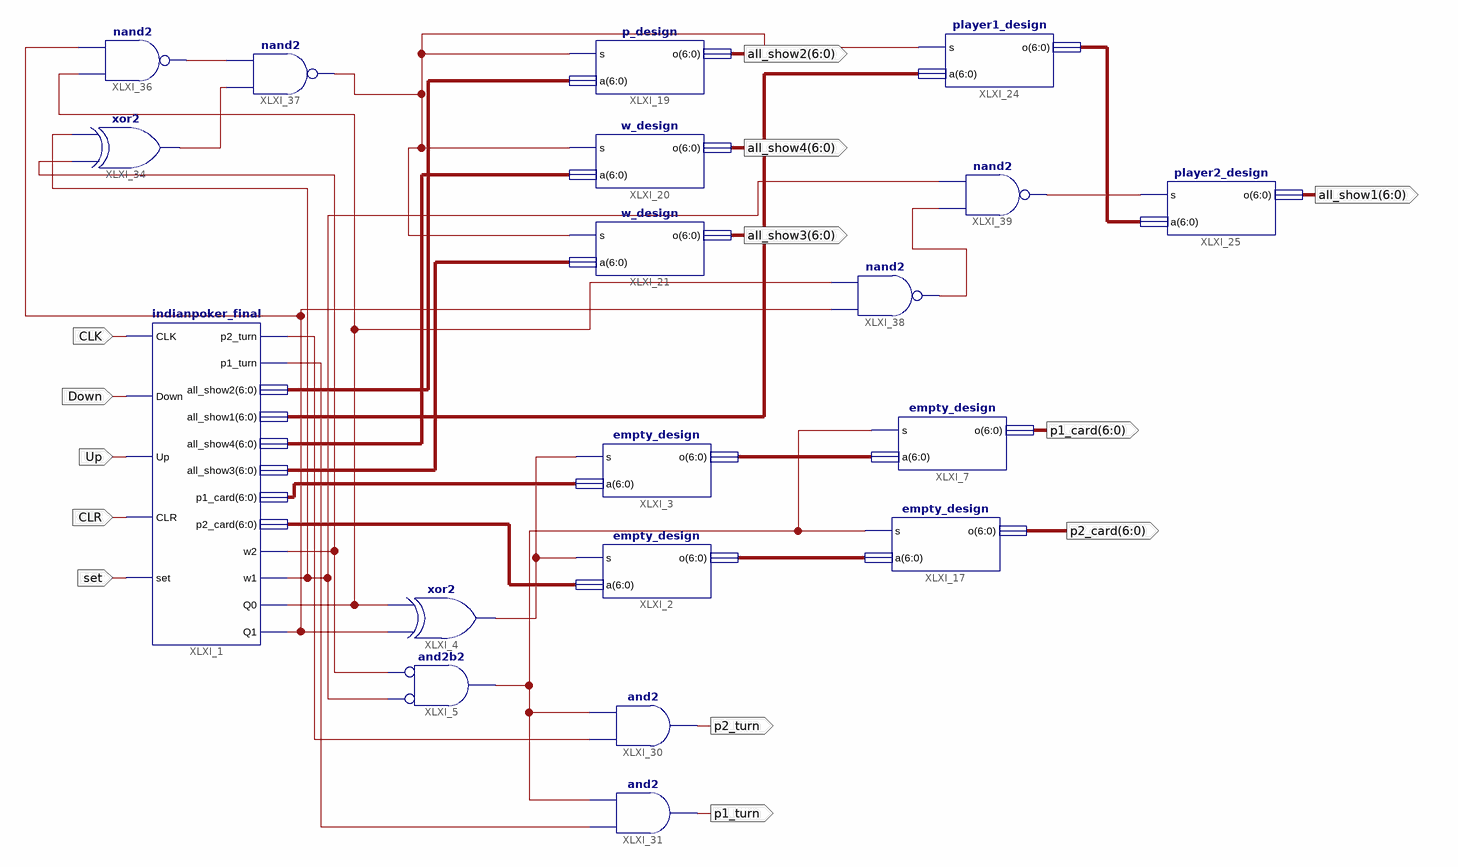
[diagram p0: schematic sheet 1]
// Xilinx ISE schematic indianpoker_final3.sch (spartan3) as structural Verilog: 19 symbols, 13 ports
module indianpoker_final3 (
  input  set,
  input  CLR,
  input  Up,
  input  Down,
  input  CLK,
  output [6:0] p1_card,
  output [6:0] p2_card,
  output [6:0] all_show2,
  output [6:0] all_show4,
  output [6:0] all_show3,
  output [6:0] all_show1,
  output p2_turn,
  output p1_turn
);

  wire a, XLXN_11, XLXN_45, XLXN_46, XLXN_49, XLXN_52, XLXN_53, XLXN_67, XLXN_68, XLXN_69, XLXN_72, XLXN_73,
       XLXN_77;
  wire [6:0] XLXN_1, XLXN_2, XLXN_8, XLXN_27, XLXN_37, XLXN_39, XLXN_40, XLXN_42, XLXN_43;

  indianpoker_final XLXI_1 (
    .CLK(CLK), .Down(Down), .Up(Up), .CLR(CLR), .set(set), .p2_turn(XLXN_53), .p1_turn(XLXN_52),
    .all_show2(XLXN_37), .all_show1(XLXN_42), .all_show4(XLXN_40), .all_show3(XLXN_39), .p1_card(XLXN_2),
    .p2_card(XLXN_1), .w2(XLXN_45), .w1(XLXN_69), .Q0(XLXN_68), .Q1(XLXN_67));
  empty_design XLXI_2 (.s(a), .a(XLXN_1), .o(XLXN_27));
  empty_design XLXI_3 (.s(a), .a(XLXN_2), .o(XLXN_8));
  xor XLXI_4 (a, XLXN_67, XLXN_68);
  and XLXI_5 (XLXN_11, ~XLXN_69, ~XLXN_45);  // and2b2
  empty_design XLXI_17 (.s(XLXN_11), .a(XLXN_27), .o(p2_card));
  empty_design XLXI_7 (.s(XLXN_11), .a(XLXN_8), .o(p1_card));
  p_design XLXI_19 (.s(XLXN_46), .a(XLXN_37), .o(all_show2));
  w_design XLXI_20 (.s(XLXN_46), .a(XLXN_40), .o(all_show4));
  w_design XLXI_21 (.s(XLXN_46), .a(XLXN_39), .o(all_show3));
  player1_design XLXI_24 (.s(XLXN_46), .a(XLXN_42), .o(XLXN_43));
  player2_design XLXI_25 (.s(XLXN_49), .a(XLXN_43), .o(all_show1));
  and XLXI_30 (p2_turn, XLXN_53, XLXN_11);
  and XLXI_31 (p1_turn, XLXN_52, XLXN_11);
  xor XLXI_34 (XLXN_72, XLXN_45, XLXN_69);
  nand XLXI_36 (XLXN_73, XLXN_68, XLXN_67);
  nand XLXI_37 (XLXN_46, XLXN_72, XLXN_73);
  nand XLXI_38 (XLXN_77, XLXN_67, XLXN_68);
  nand XLXI_39 (XLXN_49, XLXN_77, XLXN_69);
endmodule
